# Altium project 声音3.PrjPcb
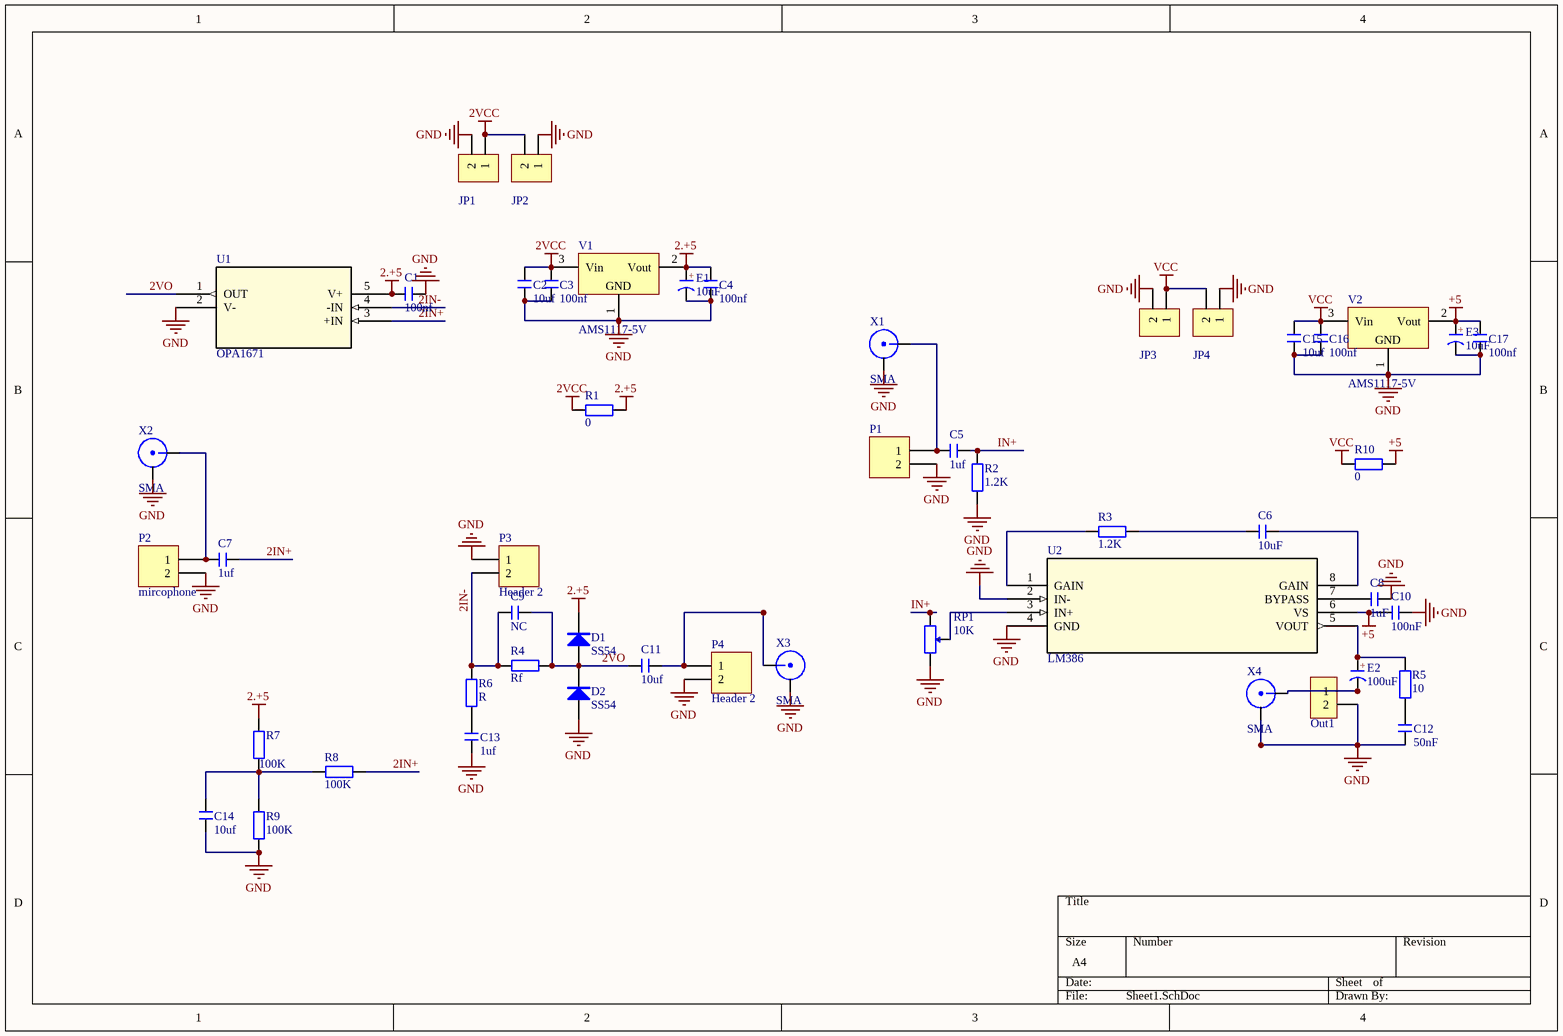
[diagram p0: Sheet1.SchDoc]
1 sheet, 50 parts. Net scope: global (net labels, ports and power ports of the same name join across sheets).
Board file: 声音.PcbDoc

## Sheet Sheet1.SchDoc
size A4; SheetNumber: 1; SheetTotal: 1

### Parts
C1  100nf  [C 0603_L]
C2  10uf  [C 0603_L]
C3  100nf  [C 0603_L]
C4  100nf  [C 0603_L]
C5  1uf  [C 0603_L]
C6  10uF  [C 0603_L]
C7  1uf  [C 0603_L]
C8  1uF  [C 0603_L]
C9  NC  [C 0603_L]
C10  100nF  [C 0603_L]
C11  10uf  [C 0603_L]
C12  50nF  [C 0603_L]
C13  1uf  [C 0603_L]
C14  10uf  [C 0603_L]
C15  10uf  [C 0603_L]
C16  100nf  [C 0603_L]
C17  100nf  [C 0603_L]
D1  SS54  [SMA]
D2  SS54  [SMA]
E1  10uF  [CD B(3528)]
E2  100uF  [CAP 2.5*6.3*7]
E3  10uF  [CD B(3528)]
JP1  HDR-1X2  [VH3.96-LI-2P]  (value not drawn)
JP2  HDR-1X2  [VH3.96-LI-2P]  (value not drawn)
JP3  HDR-1X2  [VH3.96-LI-2P]  (value not drawn)
JP4  HDR-1X2  [VH3.96-LI-2P]  (value not drawn)
Out1  HDR-1X2  [HDR2.54-LI-2P]  (value not drawn)
P1  (no value)  [HDR1X2]
P2  mircophone  [HDR1X2]
P3  Header 2  [HDR1X2]
P4  Header 2  [HDR1X2]
R1  0  [R 0603_L]
R2  1.2K  [R 0603_L]
R3  1.2K  [R 0603_L]
R4  Rf  [R 0603_L]
R5  10  [R 0603_L]
R6  R  [R 0603_L]
R7  100K  [R 0603_L]
R8  100K  [R 0603_L]
R9  100K  [R 0603_L]
R10  0  [R 0603_L]
RP1  10K  [3296W]
U1  OPA1671  [SOT23-DBV5_TEX]
U2  LM386  [SOP8_L]
V1  AMS1117-5V  [SOT223_L]
V2  AMS1117-5V  [SOT223_L]
X1  SMA  [SMA1]
X2  SMA  [SMA1]
X3  SMA  [SMA1]
X4  SMA  [SMA1]

### Nets
2.+5: C1.2 C4.2 D1.2(K) E1.1(A) R1.2 R7.2 U1.5(V+) V1.2(Vout)
2VCC: C2.2 C3.2 JP1.1 JP2.2 R1.1 V1.3(Vin)
+5: C10.1 C17.2 E3.1(A) R10.2 U2.6(VS) V2.2(Vout)
GND: C1.1 C2.1 C3.1 C4.1 C8.2 C10.2 C12.1 C13.1 C14.2 C15.1 C16.1 C17.1 D2.1(A) E1.2(K) E3.2(K) JP1.2 JP2.1 JP3.2 JP4.1 Out1.2 P1.2 P2.2 P3.1 P4.2 R2.1 R9.1 RP1.3 U1.2(V-) U2.2(IN-) U2.4(GND) V1.1(GND) V2.1(GND) X1.2 X2.2 X3.2 X4.2
VCC: C15.2 C16.2 JP3.1 JP4.2 R10.1 V2.3(Vin)
2IN+: C7.1 R8.2 U1.3(+IN)
2IN-: C9.2 P3.2 R4.2 R6.2 U1.4(-IN)
2VO: C9.1 C11.2 D1.1(A) D2.2(K) R4.1 U1.1(OUT)
IN+: C5.1 R2.2 RP1.1
NetC5_2: C5.2 P1.1 X1.1
NetC6_1: C6.1 R3.2
NetC6_2: C6.2 U2.8(GAIN)
NetC7_2: C7.2 P2.1 X2.1
NetC8_1: C8.1 U2.7(BYPASS)
NetC11_1: C11.1 P4.1 X3.1
NetC12_2: C12.2 R5.1
NetC13_2: C13.2 R6.1
NetC14_1: C14.1 R7.1 R8.1 R9.2
NetE2_1: E2.1(A) R5.2 U2.5(VOUT)
NetE2_2: E2.2(K) Out1.1 X4.1
NetR3_1: R3.1 U2.1(GAIN)
NetRP1_2: RP1.2 U2.3(IN+)

### Notes on the sheet
- (in symbol C-CAP) +
- (in symbol C-CD) +

### Library data of the parts
C1-C17 = C: 无极性贴片电容; 版权归属: 源创客; BOM名称: 无极性贴片电容; 学习资源: www.ooocke.com
D1 D2 = SR540: 肖特基二极管; BOM名称: 整流二极管; 版权归属: 源创客; 属性: 40V  5A; 学习资源: www.ooocke.com
E1 E3 = C-CD: 贴片钽电容; 版权归属: 源创客; BOM名称: 贴片钽电容; 学习资源: www.ooocke.com
E2 = C-CAP: 直插电解电容; 版权归属: 源创客; BOM名称: 直插电解电容; 学习资源: www.ooocke.com
JP1-JP4 = Header 2_1: 2P接插件; 版权归属: 源创客; BOM名称: 2P接插件; 学习资源: www.ooocke.com
Out1 = Header 2: 2P接插件; 版权归属: 源创客; BOM名称: 2P接插件; 学习资源: www.ooocke.com
P1-P4 = Header 2: Header, 2-Pin; LatestRevisionDate: 17-Jul-2002; LatestRevisionNote: Re-released for DXP Platform.; Publisher: Altium Limited
R1-R10 = R: 贴片电阻; 版权归属: 源创客; BOM名称: 贴片电阻; 学习资源: www.ooocke.com
RP1 = RP-ID: 插件单联电位器; BOM名称: 插件电位器; 版权归属: 源创客; 学习资源: www.ooocke.com
U1 = OPA1671IDBVR: 低噪声音频运算放大器; Mfr_Name: Texas Instruments; Copyright: Copyright (C) 2021 Ultra Librarian. All rights reserved.; Manufacturer_Part_Number: OPA1671IDBVR; RefDes: RefDes; Type: DEV
U2 = LM386: 700mW音频功放; Mfr_Name: Texas Instruments; Manufacturer_Part_Number: LM386M-1/NOPB; Copyright: Copyright (C) 2021 Ultra Librarian. All rights reserved.; RefDes: RefDes; Type: DEV
V1 V2 = AMS1117: 三端稳压芯片; BOM名称: 稳压芯片; 版权归属: 源创客; 学习资源: www.ooocke.com